# Altium schematic sheet Sheet1.SchDoc
size A3
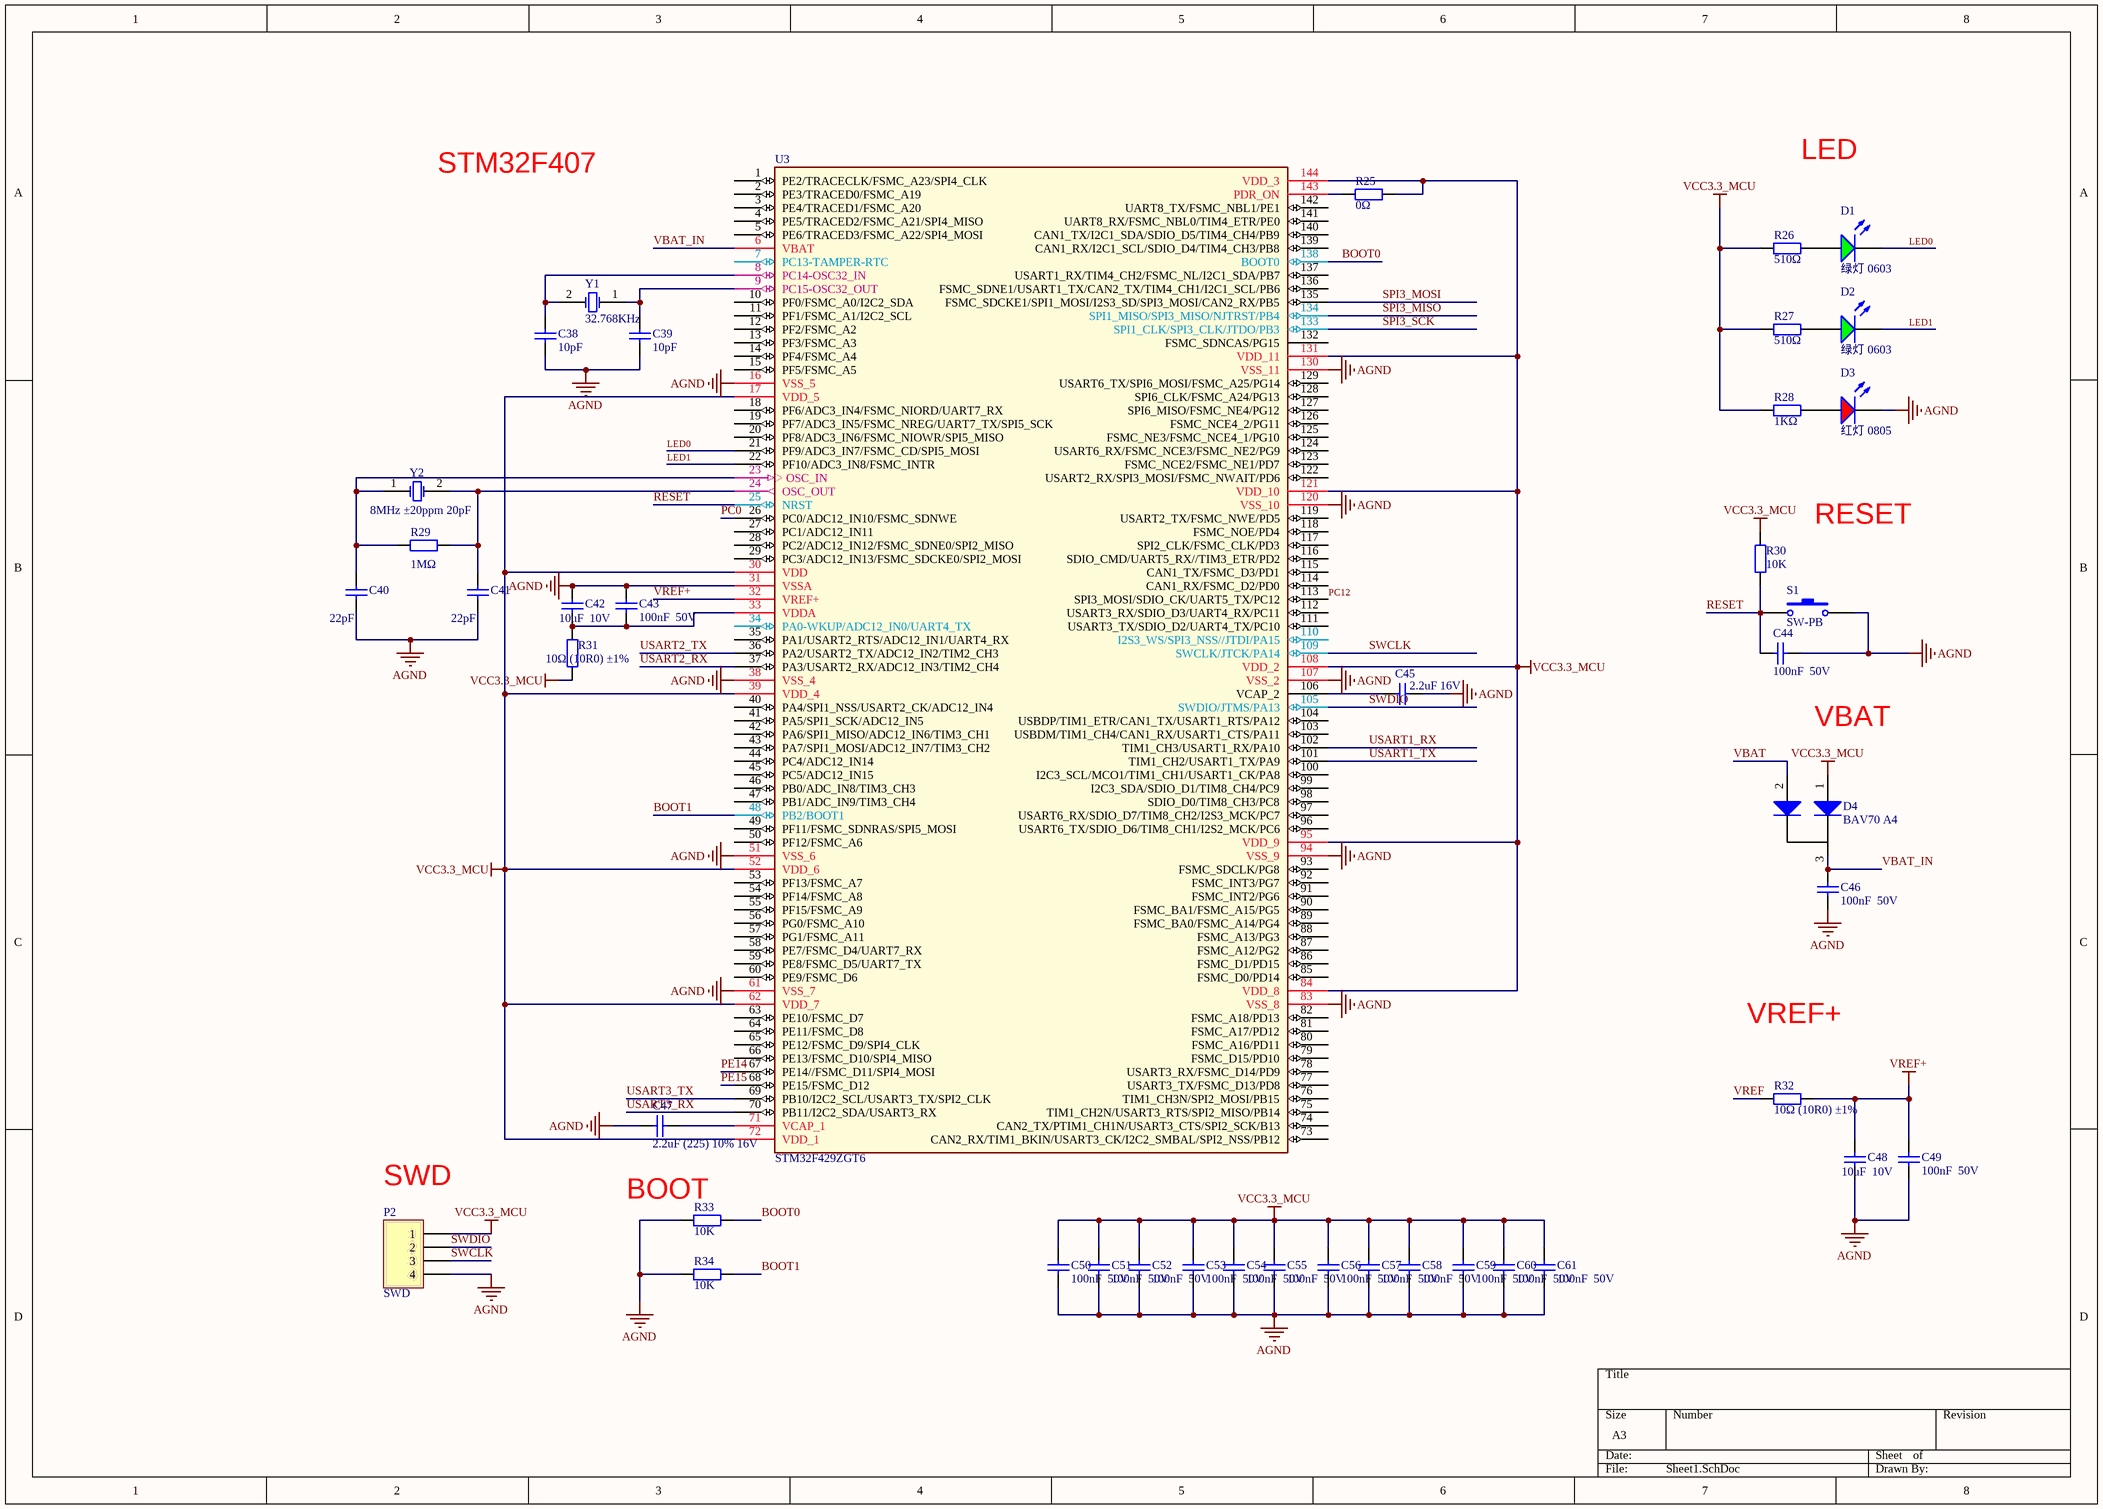
[diagram p0: Sheet1.SchDoc]

## Parts
C38  10pF  [0603_C]
C39  10pF  [0603_C]
C40  22pF  [0603_C]
C41  22pF  [0603_C]
C42  10uF  10V  [0603_C]
C43  100nF  50V  [0603_C]
C44  100nF  50V  [0603_C]
C45  2.2uF 16V  [0603_C]
C46  100nF  50V  [0603_C]
C47  2.2uF (225) 10% 16V  [0603_C]
C48  10uF  10V  [0603_C]
C49  100nF  50V  [0603_C]
C50  100nF  50V  [0603_C]
C51  100nF  50V  [0603_C]
C52  100nF  50V  [0603_C]
C53  100nF  50V  [0603_C]
C54  100nF  50V  [0603_C]
C55  100nF  50V  [0603_C]
C56  100nF  50V  [0603_C]
C57  100nF  50V  [0603_C]
C58  100nF  50V  [0603_C]
C59  100nF  50V  [0603_C]
C60  100nF  50V  [0603_C]
C61  100nF  50V  [0603_C]
D1  绿灯 0603  [0603_LED_S1]
D2  绿灯 0603  [0603_LED_S1]
D3  红灯 0805  [0805_LED_S1]
D4  BAV70 A4  [SOT-23(SOT-23-3)]
P2  SWD  [HDR1X4]
R25  0Ω  [0603_R]
R26  510Ω  [0603_R]
R27  510Ω  [0603_R]
R28  1KΩ  [0603_R]
R29  1MΩ  [0603_R]
R30  10K  [0603_R]
R31  10Ω (10R0) ±1%  [0603_R]
R32  10Ω (10R0) ±1%  [0603_R]
R33  10K  [0603_R]
R34  10K  [0603_R]
S1  SW-PB  [key_4.5*4.5*3.8]
U3  STM32F429ZGT6  [LQFP-144_20x20x05P]
Y1  32.768KHz  [SMD-5032_2P]
Y2  8MHz ±20ppm 20pF  [SMD-5032_2P]

## Nets
AGND: C38.1 C39.1 C40.1 C41.1 C42.2 C43.2 C44.1 C45.1 C46.2 C47.1 C48.1 C49.1 C50.1 C51.1 C52.1 C53.1 C54.1 C55.1 C56.1 C57.1 C58.1 C59.1 C60.1 C61.1 D3.K P2.4 R33.1 R34.1 S1.2 U3.16(VSS_5) U3.31(VSSA) U3.38(VSS_4) U3.51(VSS_6) U3.61(VSS_7) U3.83(VSS_8) U3.94(VSS_9) U3.107(VSS_2) U3.120(VSS_10) U3.130(VSS_11)
VCC3.3_MCU: C50.2 C51.2 C52.2 C53.2 C54.2 C55.2 C56.2 C57.2 C58.2 C59.2 C60.2 C61.2 D4.1(A) P2.1 R25.1 R26.1 R27.1 R28.1 R30.1 R31.1 U3.17(VDD_5) U3.30(VDD) U3.39(VDD_4) U3.52(VDD_6) U3.62(VDD_7) U3.72(VDD_1) U3.84(VDD_8) U3.95(VDD_9) U3.108(VDD_2) U3.121(VDD_10) U3.131(VDD_11) U3.144(VDD_3)
VREF+: C48.2 C49.2 R32.1 U3.32(VREF+)
BOOT0: R33.2 U3.138(BOOT0)
BOOT1: R34.2 U3.48(PB2/BOOT1)
LED0: D1.K U3.21(PF9/ADC3_IN7/FSMC_CD/SPI5_MOSI)
LED1: D2.K U3.22(PF10/ADC3_IN8/FSMC_INTR)
PC0: U3.26(PC0/ADC12_IN10/FSMC_SDNWE)
PC12: U3.113(SPI3_MOSI/SDIO_CK/UART5_TX/PC12)
PE14: U3.67(PE14//FSMC_D11/SPI4_MOSI)
PE15: U3.68(PE15/FSMC_D12)
RESET: C44.2 R30.2 S1.1 U3.25(NRST)
SPI3_MISO: U3.134(SPI1_MISO/SPI3_MISO/NJTRST/PB4)
SPI3_MOSI: U3.135(FSMC_SDCKE1/SPI1_MOSI/I2S3_SD/SPI3_MOSI/CAN2_RX/PB5)
SPI3_SCK: U3.133(SPI1_CLK/SPI3_CLK/JTDO/PB3)
SWCLK: P2.3 U3.109(SWCLK/JTCK/PA14)
SWDIO: P2.2 U3.105(SWDIO/JTMS/PA13)
USART1_RX: U3.102(TIM1_CH3/USART1_RX/PA10)
USART1_TX: U3.101(TIM1_CH2/USART1_TX/PA9)
USART2_RX: U3.37(PA3/USART2_RX/ADC12_IN3/TIM2_CH4)
USART2_TX: U3.36(PA2/USART2_TX/ADC12_IN2/TIM2_CH3)
USART3_RX: U3.70(PB11/I2C2_SDA/USART3_RX)
USART3_TX: U3.69(PB10/I2C2_SCL/USART3_TX/SPI2_CLK)
VBAT: D4.2(A)
VBAT_IN: C46.1 D4.3(K) U3.6(VBAT)
VREF: R32.2
NetC38_2: C38.2 U3.8(PC14-OSC32_IN) Y1.2(OSC2)
NetC39_2: C39.2 U3.9(PC15-OSC32_OUT) Y1.1(OSC1)
NetC40_2: C40.2 R29.1 U3.23(OSC_IN) Y2.1(OSC1)
NetC41_2: C41.2 R29.2 U3.24(OSC_OUT) Y2.2(OSC2)
NetC42_1: C42.1 C43.1 R31.2 U3.33(VDDA)
NetC45_2: C45.2 U3.106(VCAP_2)
NetC47_2: C47.2 U3.71(VCAP_1)
NetD1_A: D1.A R26.2
NetD2_A: D2.A R27.2
NetD3_A: D3.A R28.2
NetR25_2: R25.2 U3.143(PDR_ON)

Not connected (* = marked no-connect by the designer): U3 1(PE2/TRACECLK/FSMC_A23/SPI4_CLK) 2(PE3/TRACED0/FSMC_A19) 3(PE4/TRACED1/FSMC_A20) 4(PE5/TRACED2/FSMC_A21/SPI4_MISO) 5(PE6/TRACED3/FSMC_A22/SPI4_MOSI) 7(PC13-TAMPER-RTC) 10(PF0/FSMC_A0/I2C2_SDA) 11(PF1/FSMC_A1/I2C2_SCL) 12(PF2/FSMC_A2) 13(PF3/FSMC_A3) 14(PF4/FSMC_A4) 15(PF5/FSMC_A5) 18(PF6/ADC3_IN4/FSMC_NIORD/UART7_RX) 19(PF7/ADC3_IN5/FSMC_NREG/UART7_TX/SPI5_SCK) 20(PF8/ADC3_IN6/FSMC_NIOWR/SPI5_MISO) 27(PC1/ADC12_IN11) 28(PC2/ADC12_IN12/FSMC_SDNE0/SPI2_MISO) 29(PC3/ADC12_IN13/FSMC_SDCKE0/SPI2_MOSI) 34(PA0-WKUP/ADC12_IN0/UART4_TX) 35(PA1/USART2_RTS/ADC12_IN1/UART4_RX) 40(PA4/SPI1_NSS/USART2_CK/ADC12_IN4) 41(PA5/SPI1_SCK/ADC12_IN5) 42(PA6/SPI1_MISO/ADC12_IN6/TIM3_CH1) 43(PA7/SPI1_MOSI/ADC12_IN7/TIM3_CH2) 44(PC4/ADC12_IN14) 45(PC5/ADC12_IN15) 46(PB0/ADC_IN8/TIM3_CH3) 47(PB1/ADC_IN9/TIM3_CH4) 49(PF11/FSMC_SDNRAS/SPI5_MOSI) 50(PF12/FSMC_A6) 53(PF13/FSMC_A7) 54(PF14/FSMC_A8) 55(PF15/FSMC_A9) 56(PG0/FSMC_A10) 57(PG1/FSMC_A11) 58(PE7/FSMC_D4/UART7_RX) 59(PE8/FSMC_D5/UART7_TX) 60(PE9/FSMC_D6) 63(PE10/FSMC_D7) 64(PE11/FSMC_D8) 65(PE12/FSMC_D9/SPI4_CLK) 66(PE13/FSMC_D10/SPI4_MISO) 73(CAN2_RX/TIM1_BKIN/USART3_CK/I2C2_SMBAL/SPI2_NSS/PB12) 74(CAN2_TX/PTIM1_CH1N/USART3_CTS/SPI2_SCK/B13) 75(TIM1_CH2N/USART3_RTS/SPI2_MISO/PB14) 76(TIM1_CH3N/SPI2_MOSI/PB15) 77(USART3_TX/FSMC_D13/PD8) 78(USART3_RX/FSMC_D14/PD9) 79(FSMC_D15/PD10) 80(FSMC_A16/PD11) 81(FSMC_A17/PD12) 82(FSMC_A18/PD13) 85(FSMC_D0/PD14) 86(FSMC_D1/PD15) 87(FSMC_A12/PG2) 88(FSMC_A13/PG3) 89(FSMC_BA0/FSMC_A14/PG4) 90(FSMC_BA1/FSMC_A15/PG5) 91(FSMC_INT2/PG6) 92(FSMC_INT3/PG7) 93(FSMC_SDCLK/PG8) 96(USART6_TX/SDIO_D6/TIM8_CH1/I2S2_MCK/PC6) 97(USART6_RX/SDIO_D7/TIM8_CH2/I2S3_MCK/PC7) 98(SDIO_D0/TIM8_CH3/PC8) 99(I2C3_SDA/SDIO_D1/TIM8_CH4/PC9) 100(I2C3_SCL/MCO1/TIM1_CH1/USART1_CK/PA8) 103(USBDM/TIM1_CH4/CAN1_RX/USART1_CTS/PA11) 104(USBDP/TIM1_ETR/CAN1_TX/USART1_RTS/PA12) 110(I2S3_WS/SPI3_NSS//JTDI/PA15) 111(USART3_TX/SDIO_D2/UART4_TX/PC10) 112(USART3_RX/SDIO_D3/UART4_RX/PC11) 114(CAN1_RX/FSMC_D2/PD0) 115(CAN1_TX/FSMC_D3/PD1) 116(SDIO_CMD/UART5_RX//TIM3_ETR/PD2) 117(SPI2_CLK/FSMC_CLK/PD3) 118(FSMC_NOE/PD4) 119(USART2_TX/FSMC_NWE/PD5) 122(USART2_RX/SPI3_MOSI/FSMC_NWAIT/PD6) 123(FSMC_NCE2/FSMC_NE1/PD7) 124(USART6_RX/FSMC_NCE3/FSMC_NE2/PG9) 125(FSMC_NE3/FSMC_NCE4_1/PG10) 126(FSMC_NCE4_2/PG11) 127(SPI6_MISO/FSMC_NE4/PG12) 128(SPI6_CLK/FSMC_A24/PG13) 129(USART6_TX/SPI6_MOSI/FSMC_A25/PG14) 132(FSMC_SDNCAS/PG15) 136(FSMC_SDNE1/USART1_TX/CAN2_TX/TIM4_CH1/I2C1_SCL/PB6) 137(USART1_RX/TIM4_CH2/FSMC_NL/I2C1_SDA/PB7) 139(CAN1_RX/I2C1_SCL/SDIO_D4/TIM4_CH3/PB8) 140(CAN1_TX/I2C1_SDA/SDIO_D5/TIM4_CH4/PB9) 141(UART8_RX/FSMC_NBL0/TIM4_ETR/PE0) 142(UART8_TX/FSMC_NBL1/PE1)

## Notes on the sheet
- STM32F407
- LED
- RESET
- VBAT
- VREF+
- (near P2) SWD
- (near R33) BOOT

## Library data of the parts
C38 C39 = 0603 10pF (100) 5% 50V: 贴片电容; ComponentLink1Description: 供应商链接; ComponentLink1URL: http://www.szlcsc.com/product/details_1986.html; Package: 0603; Supplier: LC; SuppliersPartNumber: C1634
C40 C41 = 0603 22pF (220) 5% 50V: 贴片电容; ComponentLink1Description: 供应商链接; ComponentLink1URL: http://www.szlcsc.com/product/details_2005.html; Package: 0603; Supplier: LC; SuppliersPartNumber: C1653
C42 C48 = 0603 10uF (106) 10% 10V: 贴片电容; ComponentLink1Description: 供应商链接; ComponentLink1URL: http://www.szlcsc.com/product/details_20411.html; Package: 0603; Supplier: LC; SuppliersPartNumber: C19702
C43 C44 C46 C49-C61 = 0603 100nF (104) 10% 50V: 贴片电容; ComponentLink1Description: 供应商链接; ComponentLink1URL: http://www.szlcsc.com/product/details_15331.html; Package: 0603; Supplier: LC; SuppliersPartNumber: C14663
C45 C47 = 0603 2.2uF (225) 10% 16V: 贴片电容; ComponentLink1Description: 供应商链接; ComponentLink1URL: http://www.szlcsc.com/product/details_24366.html; Package: 0603; Supplier: LC; SuppliersPartNumber: C23630
D1 D2 = 0603 绿灯: 发光二极管; ComponentLink1Description: 供应商链接; ComponentLink1URL: http://www.szlcsc.com/product/details_73152.html; Package: 0603; Supplier: LC; SuppliersPartNumber: C72043
D3 = 0805 红灯: 发光二极管; ComponentLink1Description: 供应商链接; ComponentLink1URL: http://www.szlcsc.com/product/details_2668.html; Package: 0805; Supplier: LC; SuppliersPartNumber: C2295
D4 = SOT-23 BAV70 A4: 开关二极管; ComponentLink1Description: 供应商链接; ComponentLink1URL: http://www.szlcsc.com/product/details_70091.html; Package: SOT-23; Supplier: LC; SuppliersPartNumber: C68978
P2 = Header 4: Header, 4-Pin; LatestRevisionDate: 17-Jul-2002; LatestRevisionNote: Re-released for DXP Platform.; Publisher: Altium Limited
R25 = 0603 0Ω (0R0) 1%: 贴片电阻; ComponentLink1Description: 供应商链接; ComponentLink1URL: http://www.szlcsc.com/product/details_21903.html; Package: 0603; Supplier: LC; SuppliersPartNumber: C21189
R26 R27 = 0603 510Ω (5100) 1%: 贴片电阻; ComponentLink1Description: 供应商链接; ComponentLink1URL: http://www.szlcsc.com/product/details_23920.html; Package: 0603; Supplier: LC; SuppliersPartNumber: C23193
R28 = 0603 1KΩ (1001) 1%: 贴片电阻; ComponentLink1Description: 供应商链接; ComponentLink1URL: http://www.szlcsc.com/product/details_21904.html; Package: 0603; Supplier: LC; SuppliersPartNumber: C21190
R29 = 0603 1.2MΩ (1204) 1%: 贴片电阻; ComponentLink1Description: 供应商链接; ComponentLink1URL: http://www.szlcsc.com/product/details_23493.html; Package: 0603; Supplier: LC; SuppliersPartNumber: C22766
R30-R34 = 0603 10Ω (10R0) 1%: 贴片电阻; ComponentLink1Description: 供应商链接; ComponentLink1URL: http://www.szlcsc.com/product/details_23586.html; Package: 0603; Supplier: LC; SuppliersPartNumber: C22859
S1 = SW-PB: Switch; Published: 24-Mar-1999; LatestRevisionDate: 17-Jul-2002; LatestRevisionNote: Re-released for DXP Platform.; PackageReference: SPST-2; Publisher: Altium Limited; PackageDescription: Switch; 2 Leads
U3 = STM32F429ZGT6: ARM; ComponentLink1Description: 供应商链接; ComponentLink1URL: http://www.szlcsc.com/product/details_47529.html; Package: LQFP-144_20x20x05P; Supplier: LC; SuppliersPartNumber: C46525
Y1 Y2 = SMD-5032_2P 8MHz 20ppm 20pF: 贴片晶振; ComponentLink1Description: 供应商链接; ComponentLink1URL: http://www.szlcsc.com/product/details_117214.html; Package: SMD-5032_2P; Supplier: LC; SuppliersPartNumber: C115962